# EAGLE design IR_Schreib_Lesekopf_RS232_Neu (EAGLE 7.5.0)
Assembly variants: <unbenannt>
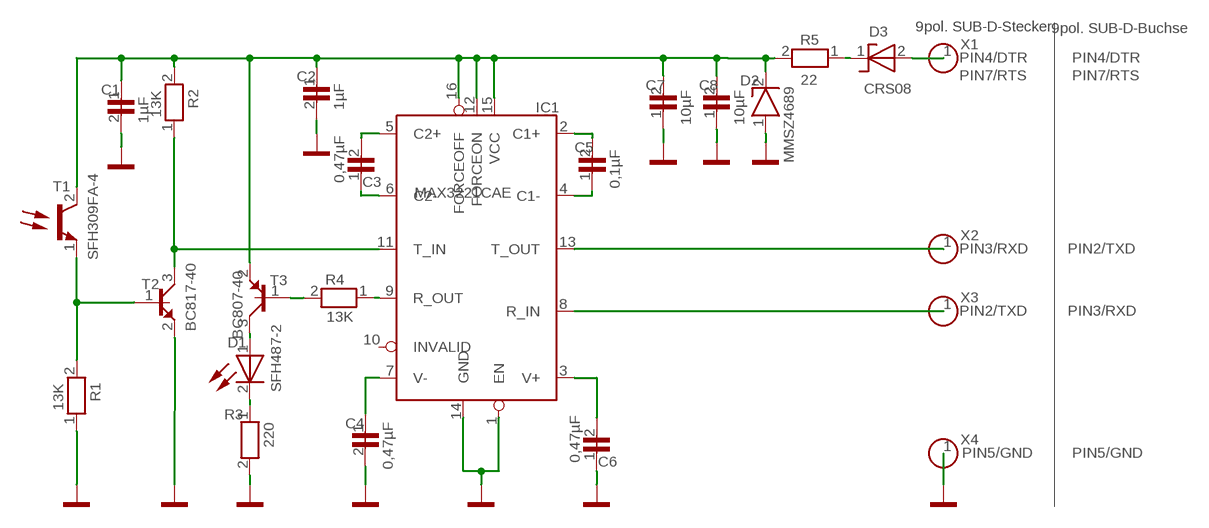
[diagram p0: schematic, sheet 1]

## Parts
C1  1µF  [0603_KLEIN]
C2  1µF  [0603_KLEIN]
C3  0,47µF  [0603]
C4  0,47µF  [0603]
C5  0,1µF  [0603]
C6  0,47µF  [0603]
C7  10µF  [0805_KLEIN]
C8  10µF  [0805_KLEIN]
D1  SFH487-2  [LED_3MM]
D2  MMSZ4689  [SOD123]
D3  CRS08  [SOD123]
IC1  MAX3221CAE  [SSOP16]
R1  13K  [0603_KLEIN]
R2  13K  [0603_KLEIN]
R3  220  [0603_KLEIN]
R4  13K  [0603_KLEIN]
R5  22  [1206]
T1  SFH309FA-4  [LED_3MM]
T2  BC817-40  [SOT23/3]
T3  BC807-40  [SOT23/3]
X1  PIN4/DTR  [LOETPUNKT]
X2  PIN3/RXD  [LOETPUNKT]
X3  PIN2/TXD  [LOETPUNKT]
X4  PIN5/GND  [LOETPUNKT]

## Nets
2: D3.1 R5.1
+: R1.2 T1.1 T2.1
B: R4.2 T3.1
C: D1.1 T3.3
C1+: C5.2 IC1.2(C1+)
C1-: C5.1 IC1.4(C1-)
C2+: C3.2 IC1.5(C2+)
C2-: C3.1 IC1.6(C2-)
GND: C1.2 C2.2 C4.2 C6.1 C7.1 C8.1 D2.1 IC1.1(EN) IC1.14(GND) R1.1 R3.2 T2.2 X4.1
K: D1.2 R3.1
PIN1: D3.2 X1.1
R_OUT: IC1.9(R_OUT) R4.1
RXD: IC1.11(T_IN) R2.1 T2.3
SIG$10: IC1.13(T_OUT) X2.1
SIG$11: IC1.8(R_IN) X3.1
V+: C6.2 IC1.3(V+)
V-: C4.1 IC1.7(V-)
VCC: C1.1 C2.1 C7.2 C8.2 D2.2 IC1.12(FORCEON) IC1.15(VCC) IC1.16(FORCEOFF) R2.2 R5.2 T1.2 T3.2
Unconnected: IC1.10(INVALID)

## Notes on the sheet
- 9pol. SUB-D-Stecker | 9pol. SUB-D-Buchse
- PIN4/DTR
- PIN7/RTS | PIN7/RTS
- PIN2/TXD
- PIN3/RXD
- PIN5/GND

## Library data of the parts
C1 C2 = TARGET3001!_V31.8.0.48:1µF: Keramik-Vielschicht-Kondensator 0,1µF, 50V
C3 C4 C6 = TARGET3001!_V31.8.0.48:0,47µF
C5 = TARGET3001!_V31.8.0.48:0,1µF
C7 C8 = TARGET3001!_V31.8.0.48:10µF
D1 = TARGET3001!_V31.8.0.48:SFH487-2: Infrarot-Dioden, Kunststoffgehäuse, IR LED, CN304 [880NM]
D2 = TARGET3001!_V31.8.0.48:MMSZ4689: Zener Diode
D3 = TARGET3001!_V31.8.0.48:CRS08: BAT 46W SCHOTTKY DIODE SMD SMD-Schottky-Dioden im SOD123-Gehäuse. BAT 46 ; V 100 ; mA 150
IC1 = TARGET3001!_V31.8.0.48:MAX3221CAE: +3V RS-232 Transceiver
R1 R2 R4 = TARGET3001!_V31.8.0.48:13K: Widerstand, allgemein
R3 = TARGET3001!_V31.8.0.48:220: Widerstand, allgemein
R5 = TARGET3001!_V31.8.0.48:22: Widerstand, allgemein
T1 = TARGET3001!_V31.8.0.48:SFH309FA-4: IR-Fototransistoren, SFH... / BP..., IR Fototransistor, SFH 309-4 [3MM, 860NM]
T2 = TARGET3001!_V31.8.0.48:BC817-40: SMD-Transistor für Verstärker und Schaltanwendung NPN
T3 = TARGET3001!_V31.8.0.48:BC807-40: NF-Transistor 45V, 1A
X1 = TARGET3001!_V31.8.0.48:PIN4/DTR: Lötpunkt
X2 = TARGET3001!_V31.8.0.48:PIN3/RXD: Lötpunkt
X3 = TARGET3001!_V31.8.0.48:PIN2/TXD: Lötpunkt
X4 = TARGET3001!_V31.8.0.48:PIN5/GND: Lötpunkt

## Board
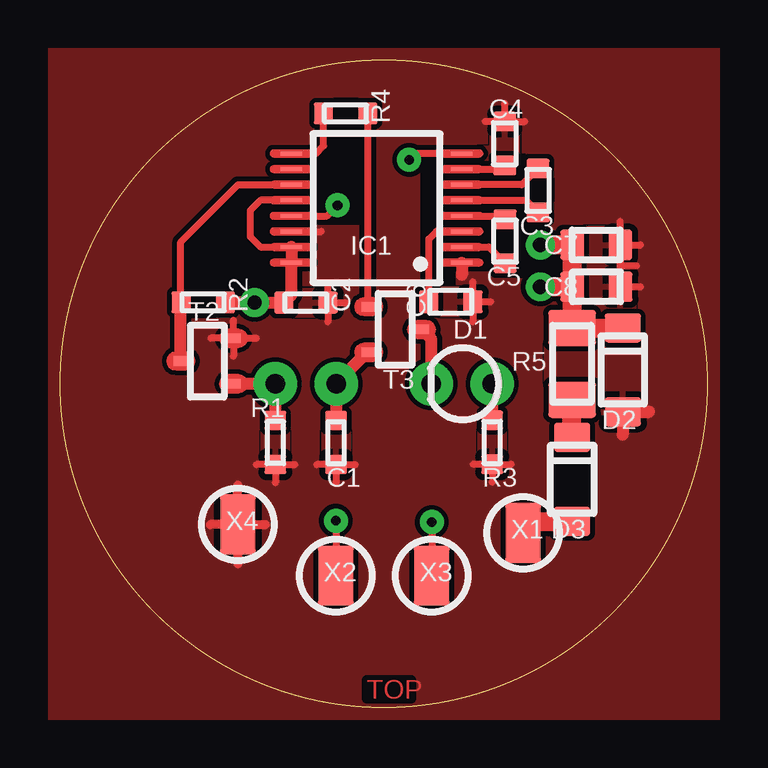
[diagram p1: board, top side]
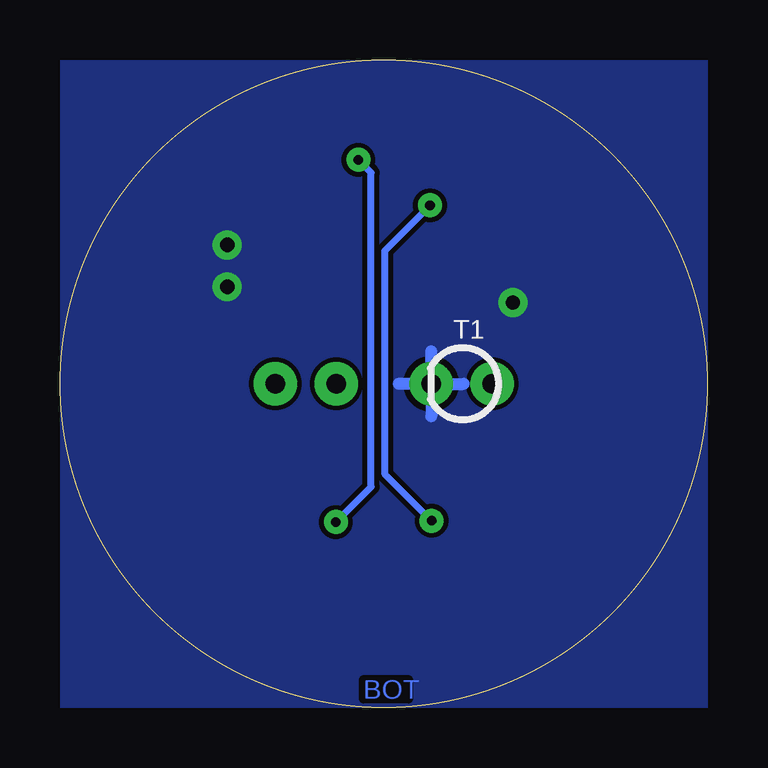
[diagram p2: board, bottom side, seen from below]

Size 27 x 27 mm. Coordinates in mm from the lower left corner, seen from the top.
Outline: circle at 13.5,13.5 radius 13.5
Copper layers (1*16): Top 0.035mm / dielectric 1.5mm / Bottom 0.035mm
Design rules "TARGET3001!": minimum track width 0.3mm, minimum drill 0.3mm, track to track 0.2mm, track to pad 0.2mm, pad to pad 0.2mm, via to via 0.2mm, smd to smd 0.2mm, copper to edge 0mm, drill to drill 0.3mm, minimum pad ring 0.5mm, minimum via ring 0.3mm, stop-mask expansion 4mil, vias tented up to drill 0mil, thermal gap 10mil
Milling: area 0,0 to 27,27

### Footprints (pad centres in the part's own frame; a part is rotated, then mirrored left to right if it is on the bottom)
0603_KLEIN = smd 0.8 x 0.9: 1 -0.917,0; 2 0.917,0
0603 = smd 0.81 x 0.95: 1 -0.917,0; 2 0.917,0
0805_KLEIN = smd 1 x 1.25: 1 1,0; 2 -1,0
LED_3MM = drill 0.8 pad 1.8 round: 1 -1.27,0; 2 1.27,0
SOD123 = smd 1.2 x 1.5: 1 -1.75,0; 2 1.75,0
SSOP16 = smd 0.165 x 0.9: 1 -2.275,-3.55; 2 -1.625,-3.55; 3 -0.975,-3.55; 4 -0.325,-3.55; 5 0.325,-3.55; 6 0.975,-3.55; 7 1.625,-3.55; 8 2.275,-3.55; 9 2.275,3.55; 10 1.625,3.55; 11 0.975,3.55; 12 0.325,3.55; 13 -0.325,3.55; 14 -0.975,3.55; 15 -1.625,3.55; 16 -2.275,3.55
1206 = smd 1.5 x 2: 1 -1.5,0; 2 1.5,0
SOT23/3 = smd 0.4 x 0.6: 1 -0.95,-1.1; 2 0.95,-1.1; 3 0,1.1
LOETPUNKT = smd 2.5 x 1.5: 1 0,0

### Placement (x,y rotation side)
C1  11.51,11.05 270 top
C2  10.25,16.89 0 top
C3  19.93,21.56 270 top
C4  18.55,23.52 90 top
C5  18.56,19.44 270 top
C6  16.29,16.92 180 top
C7  22.36,19.29 0 top
C8  22.36,17.55 0 top
D1  16.75,13.5 180 top
D2  23.46,14.08 90 top
D3  21.35,9.52 90 top
IC1  13.2,20.82 90 top
R1  8.98,11.05 90 top
R2  5.97,16.89 0 top
R3  18.02,11.06 270 top
R4  11.91,24.77 0 top
R5  21.35,14.33 90 top
T1  10.25,13.5 180 bottom
T2  6.14,14.45 90 top
T3  13.97,15.76 270 top
X1  19.31,7.28 270 top
X2  11.5,5.5 270 top
X3  15.5,5.5 270 top
X4  7.42,7.63 270 top

### Tracks (layer width: path | path; a pad name or v marks a point on that pad's centre or on a via)
2
  Top 0.8: R5.1 21.35,11.27
+
  Top 0.5: R1.2 T1.1 T2.1
B
  Top 0.3: R4.2 12.83,16.76 T3.1
C
  Top 0.5: 15.48,13.5 15.48,15.36 T3.3
C1+
  Top 0.3: IC1.2 17.88,19.2 C5.2
C1-
  Top 0.3: IC1.4 18.42,20.5 C5.1
C2+
  Top 0.3: IC1.5 19.42,21.15 C3.2
C2-
  Top 0.3: C3.1 19.26,21.8 IC1.6
GND
  Top 0.3: IC1.14 10.9,19.85 | C4.2 19.37,24.43 | C4.2 18.55,25.19 | C4.2 17.72,24.43 | C6.1 17.97,16.92 | C6.1 17.21,17.74 | C6.1 17.21,16.09 | 24.21,17.55 C8.1 23.36,18.52 | R1.1 9.78,10.13 | R1.1 8.18,10.13 | R1.1 8.98,9.38 | C1.2 12.31,10.13 | C1.2 10.71,10.13 | C1.2 11.51,9.38 | C2.2 11.17,17.68 | C2.2 11.17,16.09 | R3.2 18.82,10.14 | R3.2 17.22,10.14 | R3.2 18.02,9.39 | T2.2 8.19,15.4 | T2.2 7.24,16.15 | T2.2 6.29,15.4 | T2.2 7.24,14.65 | C7.1 24.21,19.29 | C7.1 23.36,20.26 | C7.1 23.36,18.42 | C2.2 11.92,16.89 | 23.36,18.42 23.36,18.31 23.36,18.42 | 23.36,18.42 24.04,18.42
  Top 0.375: X4.1 8.55,7.63 | X4.1 7.42,9.27 | X4.1 6.28,7.63 | X4.1 7.42,6
  Top 0.5: IC1.1 16.75,18.04 | 24.56,12.33 D2.1 23.46,11.38
  pour Top: 27.5,-0.5 27.5,27.5 -0.5,27.5 -0.5,-0.5
K
  Top 0.5: 18.02,13.5 R3.1
PIN1
  Top 0.8: X1.1 19.8,7.77 21.35,7.77
R_OUT
  Top 0.3: IC1.9 10.67,23.1 10.99,23.42 R4.1
RXD
  Top 0.3: 5.04,16.88 5.04,19.41 7.42,21.8 IC1.11
  Top 0.5: T2.3 5.04,16.88 R2.1
SIG$10  (via drill 0.4 pad 1)
  Top 0.3: IC1.13 11.13,20.5 v11.57,20.94 | X2.1 v11.5,7.79 v11.51,7.79
  Bottom 0.3: v11.57,20.94 11.57,20.92 13.46,19.03 13.46,9.74 v11.51,7.79
SIG$11  (via drill 0.4 pad 1)
  Top 0.3: IC1.8 14.82,23.1 v14.56,22.84 | v15.5,7.74 X3.1
  Bottom 0.3: v14.56,22.84 14.02,22.3 14.02,9.2 v15.5,7.74
V+
  Top 0.3: C6.2 15.38,19.54 15.69,19.85 IC1.3
V-
  Top 0.3: IC1.7 18.4,22.45 C4.1
VCC  (via drill 0.6 pad 1.2)
  Top 0.3: IC1.12 8.36,21.15 7.93,20.72 7.93,19.63 8.36,19.2 IC1.15 | C2.1
  Top 0.5: C1.1 T1.2 12.83,14.81 T3.2 | IC1.15 IC1.16 9.65,17.2 C2.1 | R2.2 v8.11,16.89 C2.1 | C2.1 | C2.1
  Top 0.8: R5.2 D2.2 | R5.2 21.36,15.84 | R5.2 21.36,15.84 | 21.36,15.84 21.37,17.54 | 21.37,17.54 21.37,19.29 v20.03,19.29 20.16,19.29 | 21.37,17.54 C8.2 | 21.37,17.54 v20.03,17.54 20.15,17.55
  Bottom 0.5: T1.2 12.87,13.5 | T1.2 11.52,14.85 | T1.2 10.17,13.5 | T1.2 11.52,12.15
  pour Bottom: 27,0 27,27 0,27 0,0
  cutout Top: 17.41,22.65 17.42,22.65 17.43,22.65 17.43,22.66 17.43,22.67 17.42,22.67 17.41,22.67 17.4,22.67 17.4,22.66 17.4,22.65
  cutout Top: 17.52,19.05 17.52,19.04 17.53,19.03 17.54,19.04 17.54,19.04 17.55,19.06 17.54,19.07 17.54,19.08 17.53,19.07 17.52,19.07
  cutout Top: 20.37,7.16 20.37,7.15 20.37,7.14 20.38,7.14 20.39,7.14 20.9,7.66 20.91,7.66 20.9,7.67 20.89,7.68 20.88,7.67
  cutout Top: 16.25,20.01 16.25,20.02 16.24,20.03 16.23,20.02 16.23,20.01 16.23,19.05 16.23,19.04 16.24,19.03 16.25,19.04 16.25,19.05
  cutout Top: 16.22,22.61 16.22,22.61 16.23,22.6 16.24,22.61 16.25,22.61 16.25,23.22 16.24,23.23 16.23,23.23 16.22,23.23 16.22,23.22
  cutout Top: 12.41,25.4 12.42,25.41 12.42,25.42 12.42,25.42 12.41,25.43 11.42,25.43 11.41,25.42 11.41,25.42 11.41,25.41 11.42,25.4
  cutout Top: 12.4,25.41 12.4,25.41 12.41,25.4 12.42,25.41 12.42,25.41 12.42,25.42 12.42,25.42 12.41,25.43 12.4,25.42 12.4,25.42
  cutout Top: 12.53,20.14 12.54,20.15 12.54,20.15 12.54,20.16 12.53,20.17 10.79,20.17 10.78,20.16 10.78,20.15 10.78,20.15 10.79,20.14
  cutout Top: 9.77,17.55 9.76,17.54 9.75,17.53 9.76,17.52 9.77,17.52 10.72,17.52 10.72,17.52 10.73,17.53 10.72,17.54 10.72,17.55
  cutout Top: 10.77,16.22 10.78,16.23 10.78,16.24 10.78,16.25 10.77,16.25 9.69,16.25 9.69,16.25 9.68,16.24 9.69,16.23 9.69,16.22
  cutout Top: 10.78,16.24 10.78,16.25 10.77,16.25 10.76,16.25 10.76,16.24 10.76,16.24 10.76,16.23 10.77,16.22 10.78,16.23 10.78,16.24
  cutout Top: 16.78,17.58 16.79,17.58 16.79,17.59 16.79,17.6 16.78,17.6 15.8,17.6 15.8,17.6 15.79,17.59 15.8,17.58 15.8,17.58
  cutout Top: 16.77,17.59 16.77,17.58 16.78,17.58 16.79,17.58 16.79,17.59 16.79,17.59 16.79,17.6 16.78,17.6 16.77,17.6 16.77,17.59
  cutout Top: 16.8,16.23 16.81,16.24 16.81,16.25 16.81,16.25 16.8,16.26 15.78,16.26 15.77,16.25 15.76,16.25 15.77,16.24 15.78,16.23
  cutout Top: 16.81,16.25 16.81,16.25 16.8,16.26 16.79,16.25 16.79,16.25 16.79,16.25 16.79,16.24 16.8,16.23 16.81,16.24 16.81,16.25
  cutout Top: 19.43,17.91 19.43,17.92 19.44,17.92 19.43,17.93 19.43,17.94 19.05,17.94 19.04,17.93 19.03,17.92 19.04,17.92 19.05,17.91
  cutout Top: 20.59,21.1 20.6,21.09 20.6,21.09 20.61,21.09 20.62,21.1 20.62,22.06 20.61,22.07 20.6,22.07 20.6,22.07 20.59,22.06
  cutout Top: 20.6,21.11 20.59,21.11 20.59,21.1 20.59,21.09 20.6,21.09 20.6,21.09 20.61,21.09 20.62,21.1 20.61,21.11 20.6,21.11
  cutout Top: 17.86,23.46 17.86,23.46 17.87,23.45 17.88,23.46 17.88,23.46 17.88,23.99 17.88,24 17.87,24 17.86,24 17.86,23.99
  cutout Top: 17.43,23.48 17.42,23.47 17.41,23.46 17.42,23.46 17.43,23.45 17.87,23.45 17.88,23.46 17.88,23.46 17.88,23.47 17.87,23.48
  cutout Top: 19.21,23.08 19.21,23.07 19.22,23.07 19.23,23.07 19.23,23.08 19.23,24.01 19.23,24.01 19.22,24.02 19.21,24.01 19.21,24.01
  cutout Top: 19.4,23.07 19.4,23.07 19.41,23.08 19.4,23.09 19.4,23.09 19.22,23.09 19.21,23.09 19.21,23.08 19.21,23.07 19.22,23.07
  cutout Top: 22.84,20.1 22.85,20.1 22.85,20.11 22.85,20.12 22.84,20.13 21.83,20.13 21.82,20.12 21.81,20.11 21.82,20.1 21.83,20.1
  cutout Top: 24.04,16.54 24.05,16.53 24.06,16.53 24.06,16.53 24.07,16.54 24.07,16.93 24.06,16.94 24.06,16.95 24.05,16.94 24.04,16.93
  cutout Top: 24.4,12.9 24.4,12.89 24.41,12.89 24.42,12.89 24.42,12.9 24.42,15.28 24.42,15.28 24.41,15.29 24.4,15.28 24.4,15.28
  cutout Top: 24.41,12.91 24.4,12.91 24.39,12.9 24.4,12.89 24.41,12.89 24.41,12.89 24.42,12.89 24.42,12.9 24.42,12.91 24.41,12.91
  cutout Top: 20.14,13.51 20.14,13.5 20.15,13.5 20.16,13.5 20.16,13.51 20.16,15.19 20.16,15.19 20.15,15.2 20.14,15.19 20.14,15.19
  cutout Top: 18.66,10.5 18.66,10.49 18.67,10.49 18.68,10.49 18.68,10.5 18.68,11.61 18.68,11.61 18.67,11.62 18.66,11.61 18.66,11.61
  cutout Top: 18.67,10.51 18.66,10.51 18.66,10.5 18.66,10.49 18.67,10.49 18.67,10.49 18.68,10.49 18.68,10.5 18.68,10.51 18.67,10.51
  cutout Top: 17.36,10.55 17.36,10.54 17.37,10.54 17.38,10.54 17.39,10.55 17.39,11.59 17.38,11.6 17.37,11.61 17.36,11.6 17.36,11.59
  cutout Top: 12.15,10.49 12.15,10.48 12.16,10.48 12.17,10.48 12.18,10.49 12.18,11.56 12.17,11.57 12.16,11.57 12.15,11.57 12.15,11.56
  cutout Top: 12.16,10.51 12.15,10.5 12.15,10.49 12.15,10.48 12.16,10.48 12.16,10.48 12.17,10.48 12.18,10.49 12.17,10.5 12.16,10.51
  cutout Top: 10.85,10.53 10.85,10.52 10.86,10.52 10.87,10.52 10.88,10.53 10.88,11.55 10.87,11.56 10.86,11.56 10.85,11.56 10.85,11.55
  cutout Top: 9.62,10.53 9.62,10.52 9.63,10.52 9.64,10.52 9.64,10.53 9.64,11.53 9.64,11.54 9.63,11.55 9.62,11.54 9.62,11.53
  cutout Top: 8.32,10.54 8.32,10.53 8.33,10.53 8.34,10.53 8.35,10.54 8.35,11.55 8.34,11.56 8.33,11.56 8.32,11.56 8.32,11.55
  cutout Top: 8.33,10.55 8.32,10.55 8.31,10.54 8.32,10.53 8.33,10.53 8.33,10.53 8.34,10.53 8.35,10.54 8.34,10.55 8.33,10.55
  cutout Top: 6.47,17.53 6.48,17.53 6.49,17.54 6.48,17.55 6.47,17.55 5.46,17.55 5.45,17.55 5.45,17.54 5.45,17.53 5.46,17.53
  cutout Top: 6.5,16.23 6.51,16.24 6.51,16.25 6.51,16.25 6.5,16.26 5.4,16.26 5.4,16.25 5.39,16.25 5.4,16.24 5.4,16.23
  cutout Top: 22.27,8.29 22.28,8.28 22.29,8.27 22.3,8.28 22.3,8.29 22.3,10.7 22.3,10.71 22.29,10.71 22.28,10.71 22.27,10.7
  cutout Top: 20.39,8.27 20.4,8.27 20.4,8.26 20.41,8.27 20.42,8.27 20.42,10.7 20.41,10.71 20.4,10.71 20.4,10.71 20.39,10.7
  cutout Top: 20.4,8.26 20.41,8.26 20.42,8.26 20.42,8.27 20.42,8.28 20.41,8.28 20.4,8.29 20.4,8.28 20.39,8.27 20.4,8.27
  cutout Top: 16.47,17.59 16.48,17.58 16.49,17.58 16.5,17.58 16.5,17.59 16.5,18.21 16.5,18.22 16.49,18.22 16.48,18.22 16.47,18.21
  cutout Top: 16.49,17.58 16.5,17.58 16.5,17.59 16.5,17.59 16.49,17.6 16.49,17.6 16.48,17.6 16.47,17.59 16.48,17.58 16.48,17.58
  cutout Top: 15.06,22.54 15.06,22.55 15.05,22.56 15.04,22.55 15.04,22.54 15.04,19.44 15.04,19.43 15.05,19.43 15.06,19.43 15.06,19.44
  cutout Top: 15.07,22.55 15.07,22.55 15.07,22.56 15.06,22.57 15.05,22.56 15.04,22.55 15.04,22.54 15.04,22.54 15.05,22.53 15.06,22.54
  cutout Top: 17.96,18.19 17.97,18.2 17.97,18.21 17.97,18.22 17.96,18.22 17.45,18.22 17.45,18.22 17.44,18.21 17.45,18.2 17.45,18.19
  cutout Top: 17.95,18.19 17.96,18.18 17.96,18.18 17.97,18.18 17.98,18.19 17.97,18.21 17.97,18.22 17.96,18.22 17.95,18.21 17.95,18.21

### Text on the board
Top: TOP
Bottom: BOT
Measures: 27 | 27